# EasyEDA schematic SCH_eVSIF MB v0.2 MPSEE_2024-01-02.json

## Sheets
1 FT232: TITLE: FT232H; REV: 1.0; Date: 2023-12-28; Sheet: 1/1; Drawn By: Denjhang; Company: Denjiang's OSHW
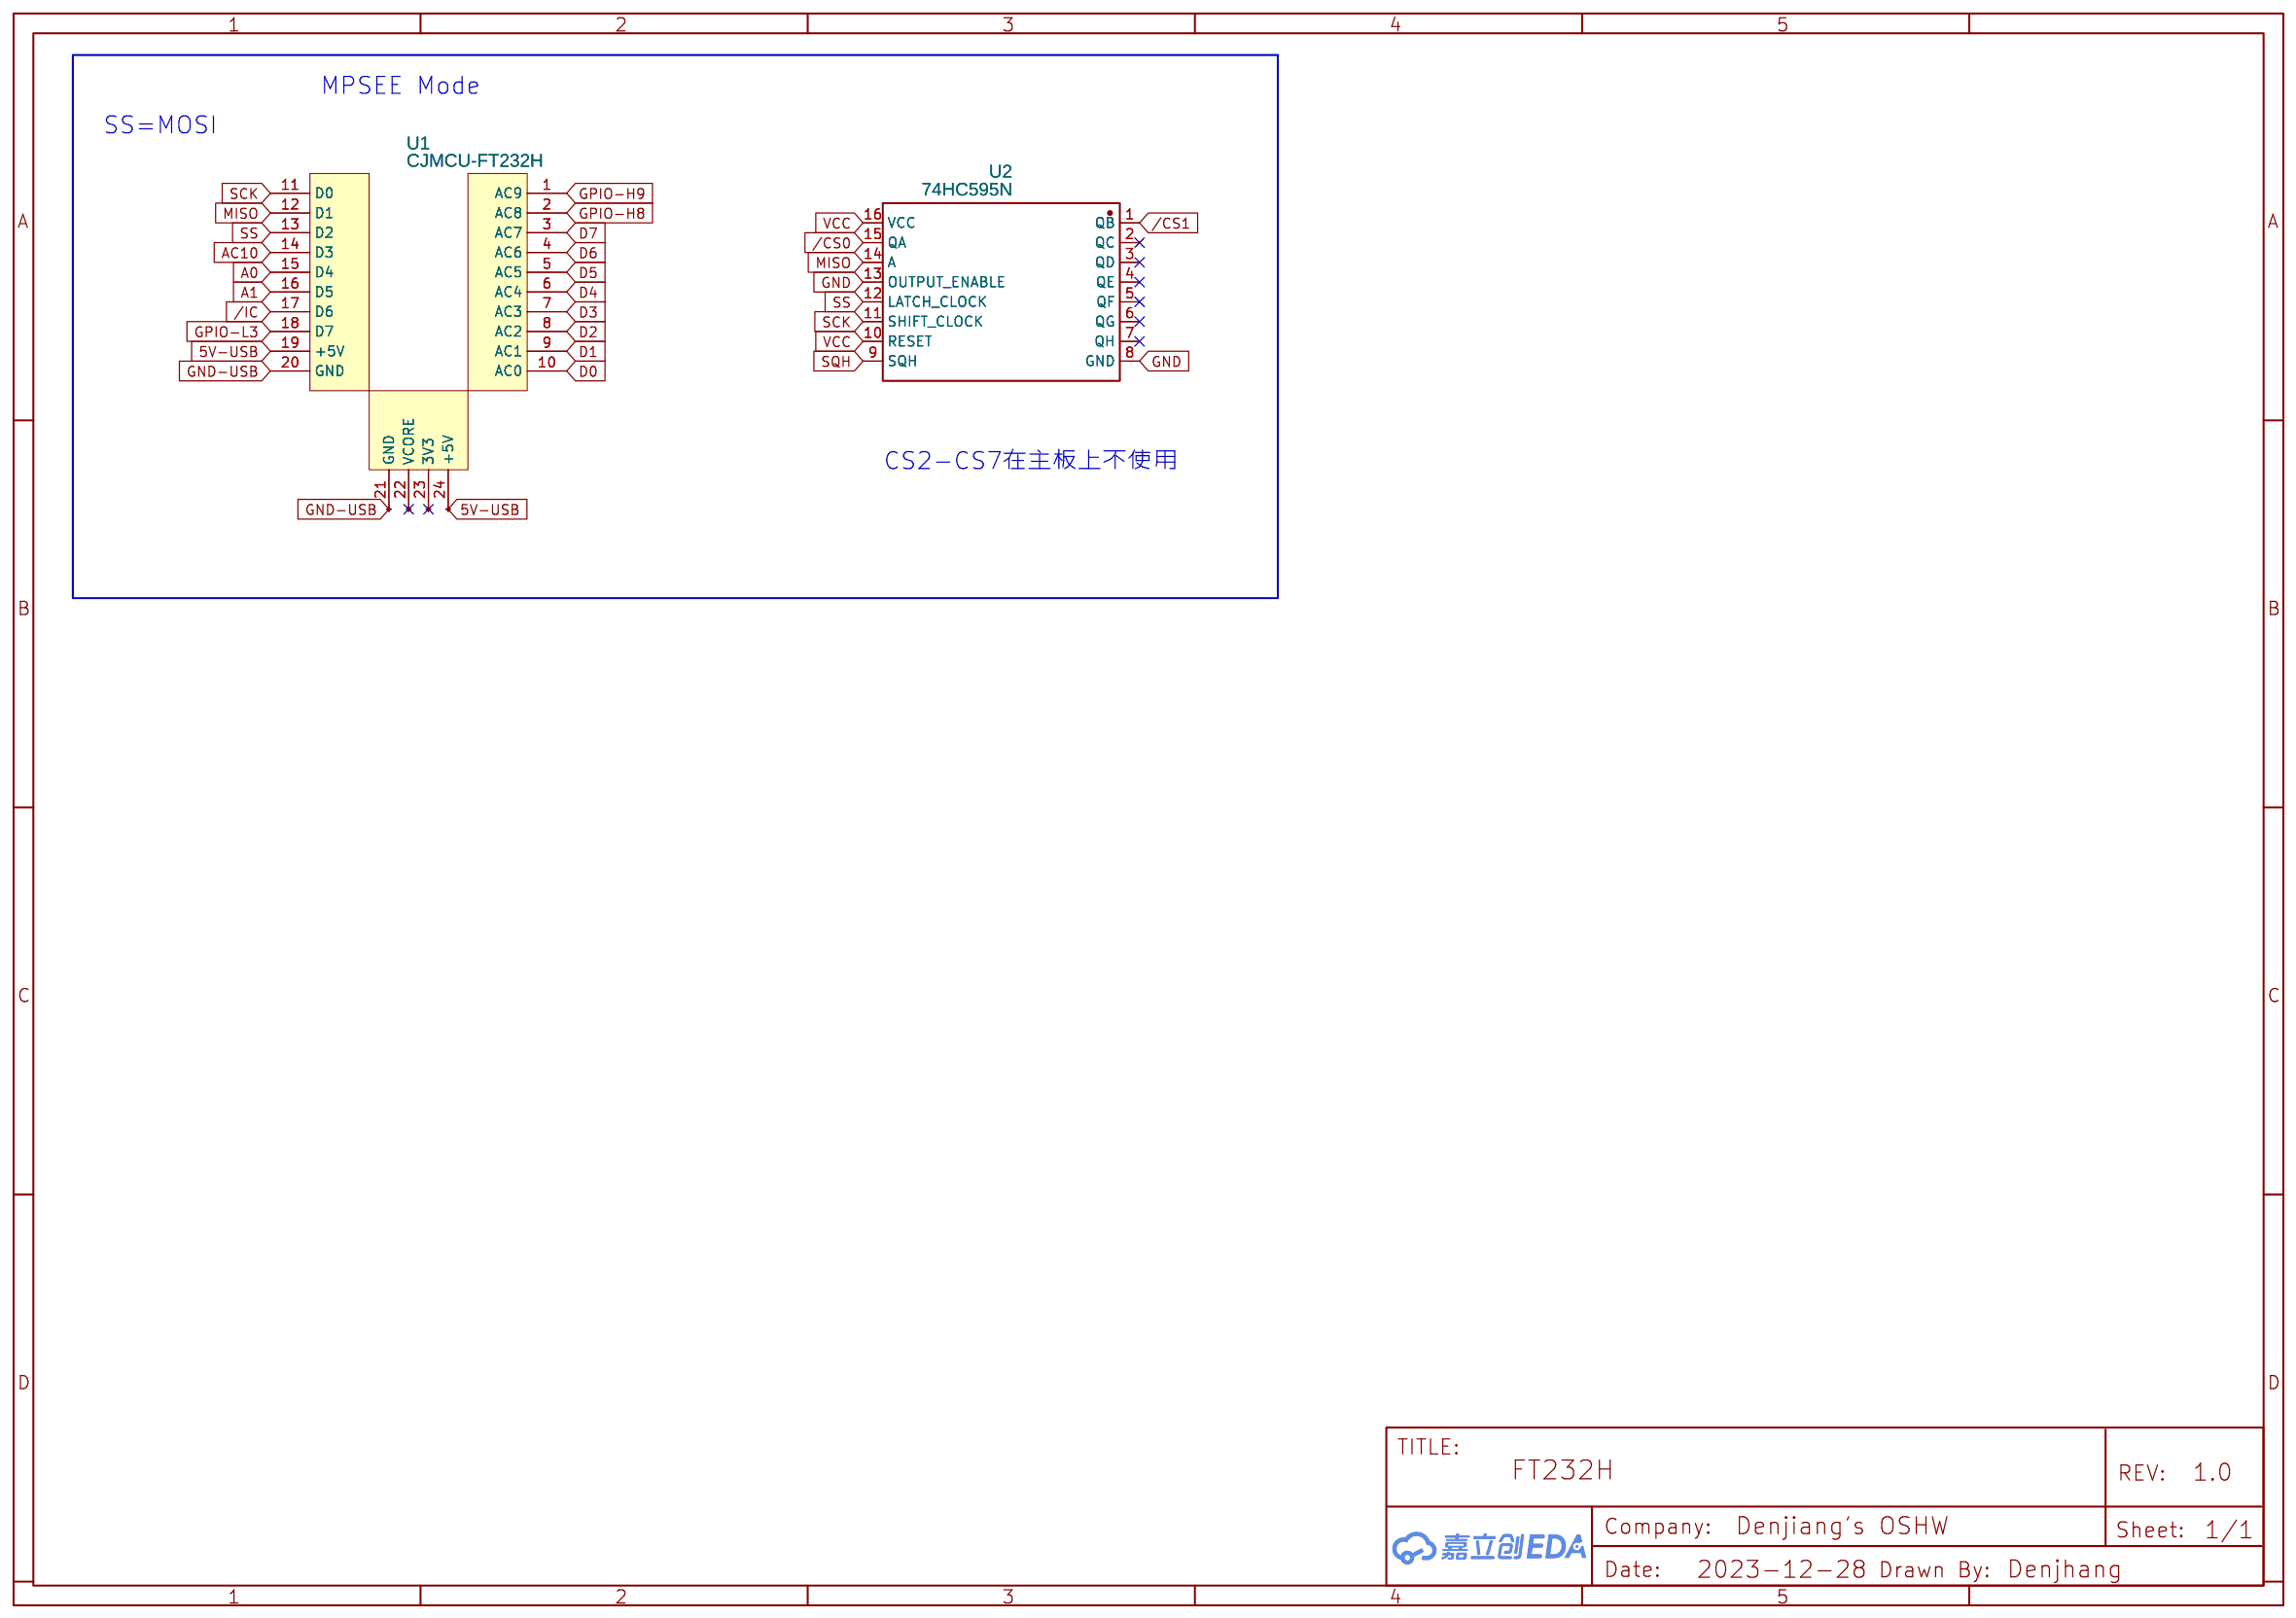
[diagram p0: FT232]
2 RE-BUS: TITLE: RE:birth BUS
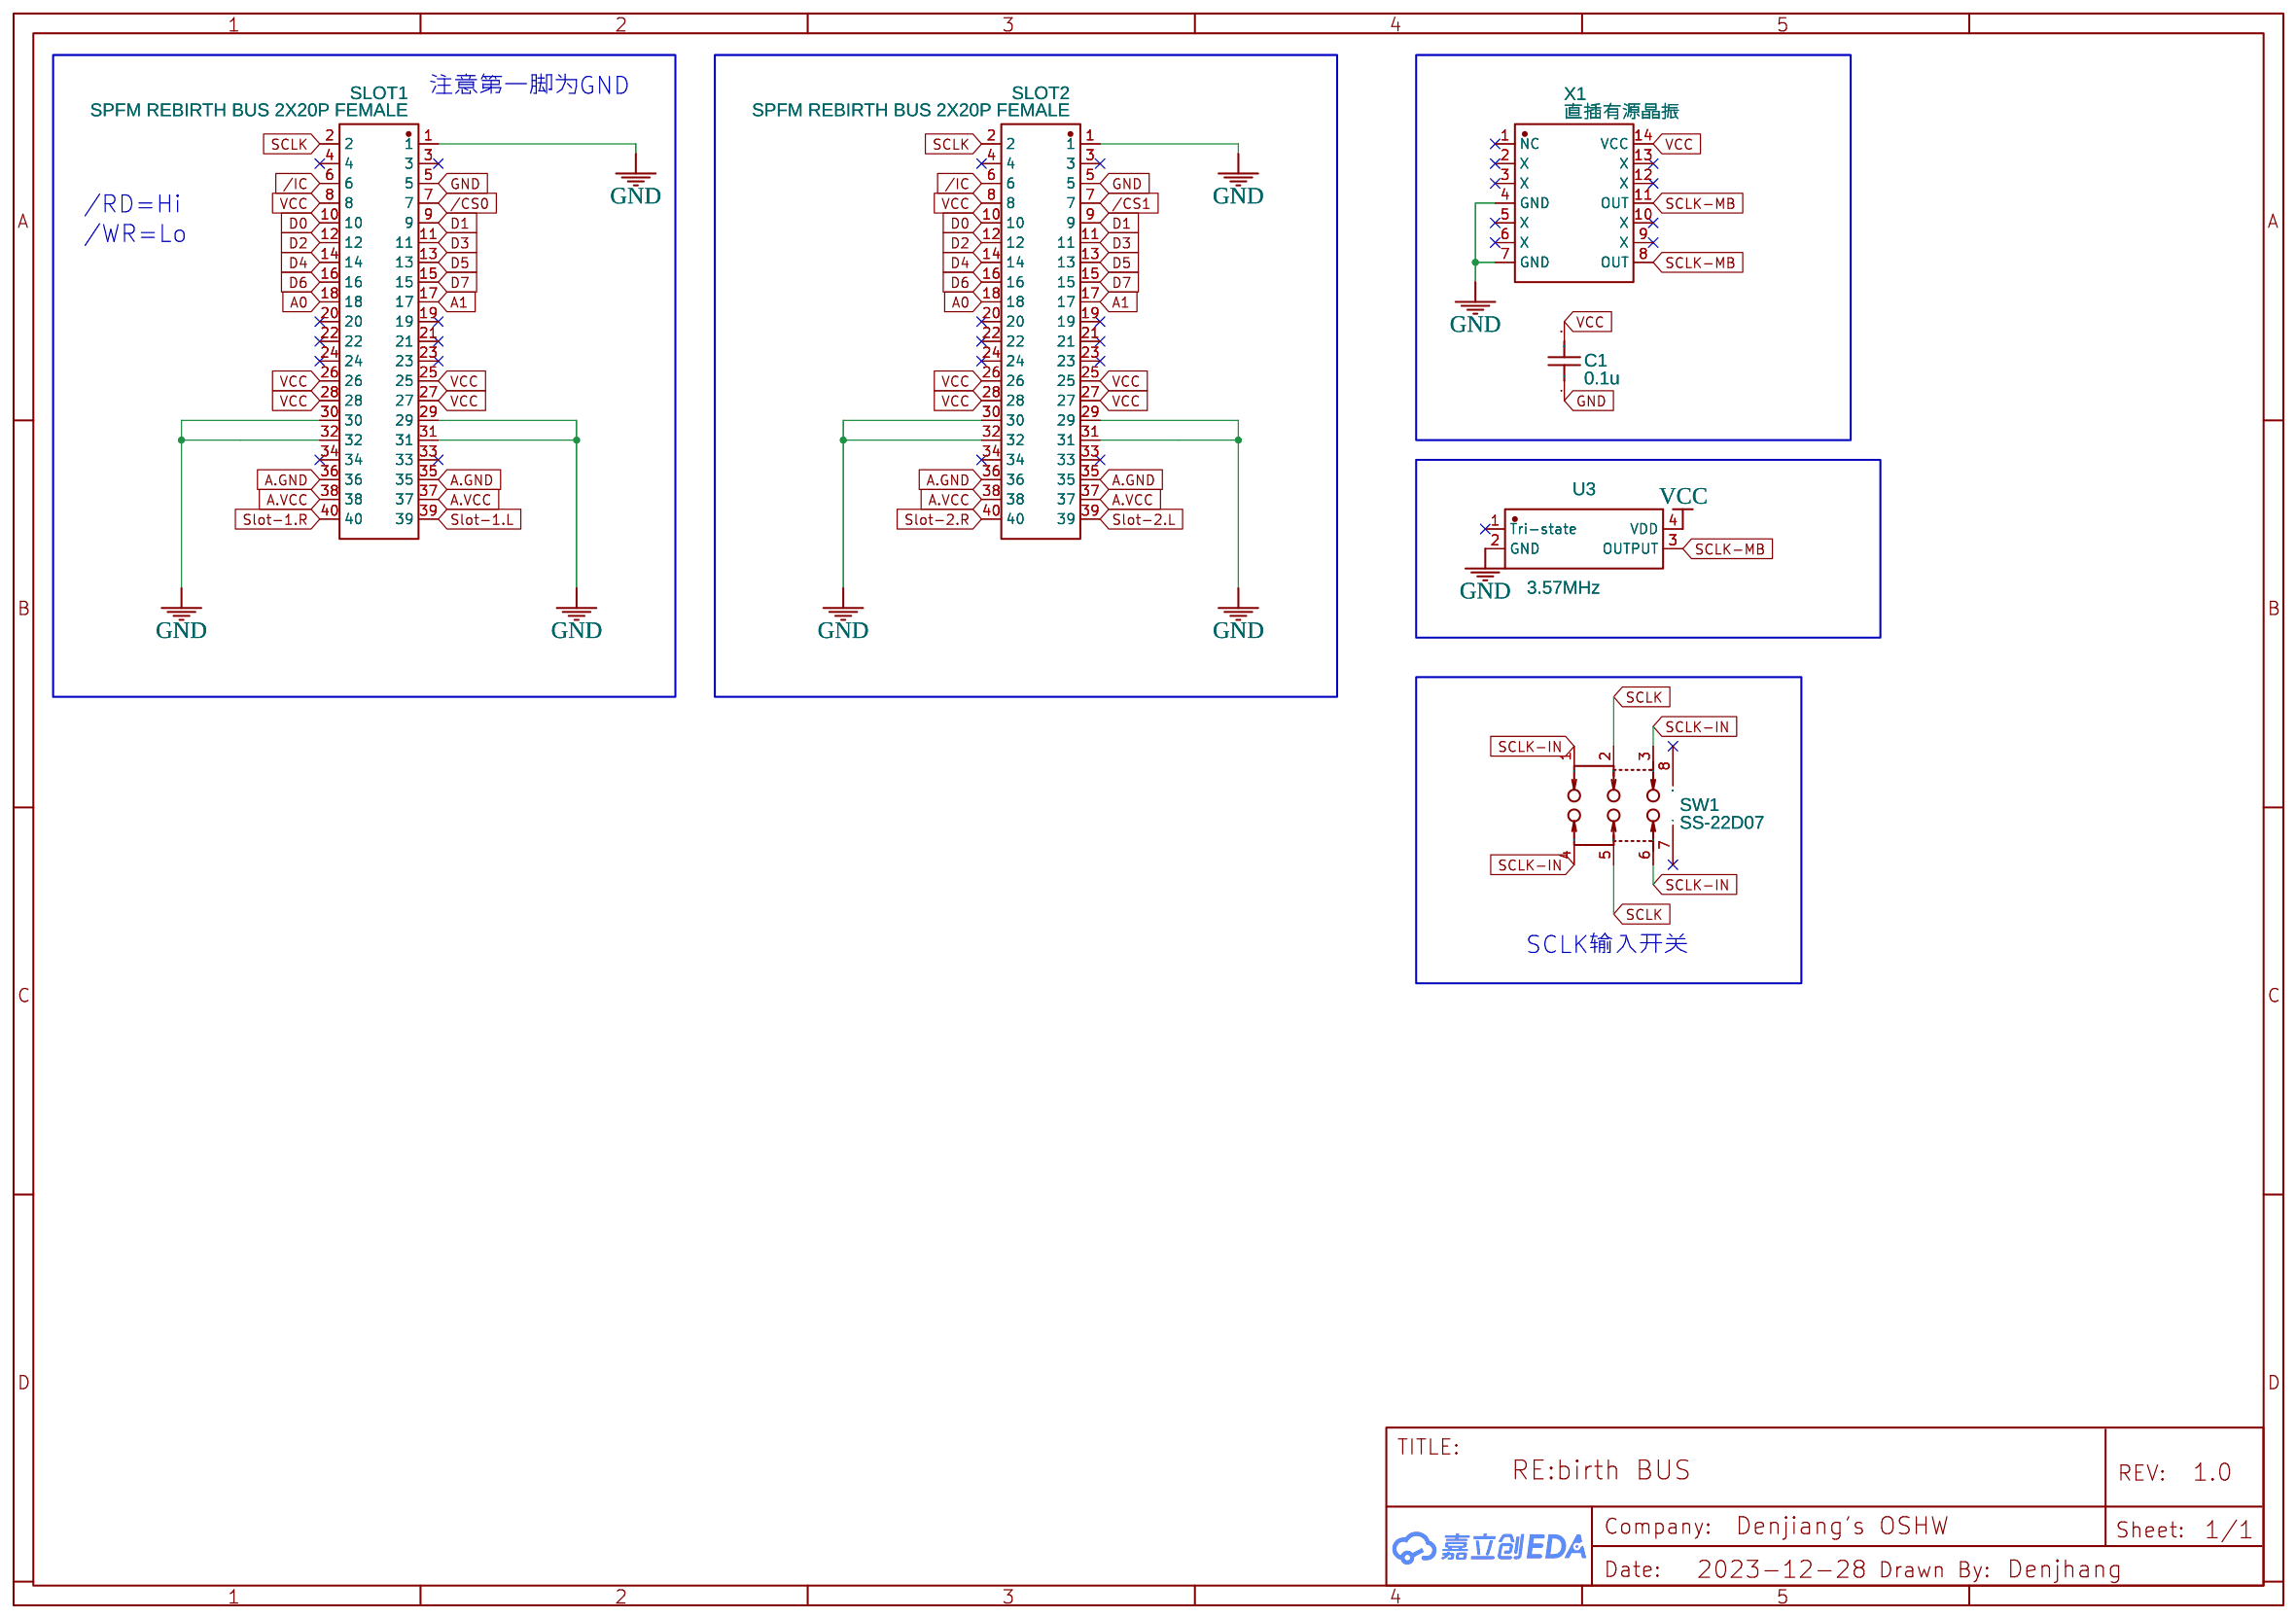
[diagram p1: RE-BUS]
3 PSU: TITLE: PSU
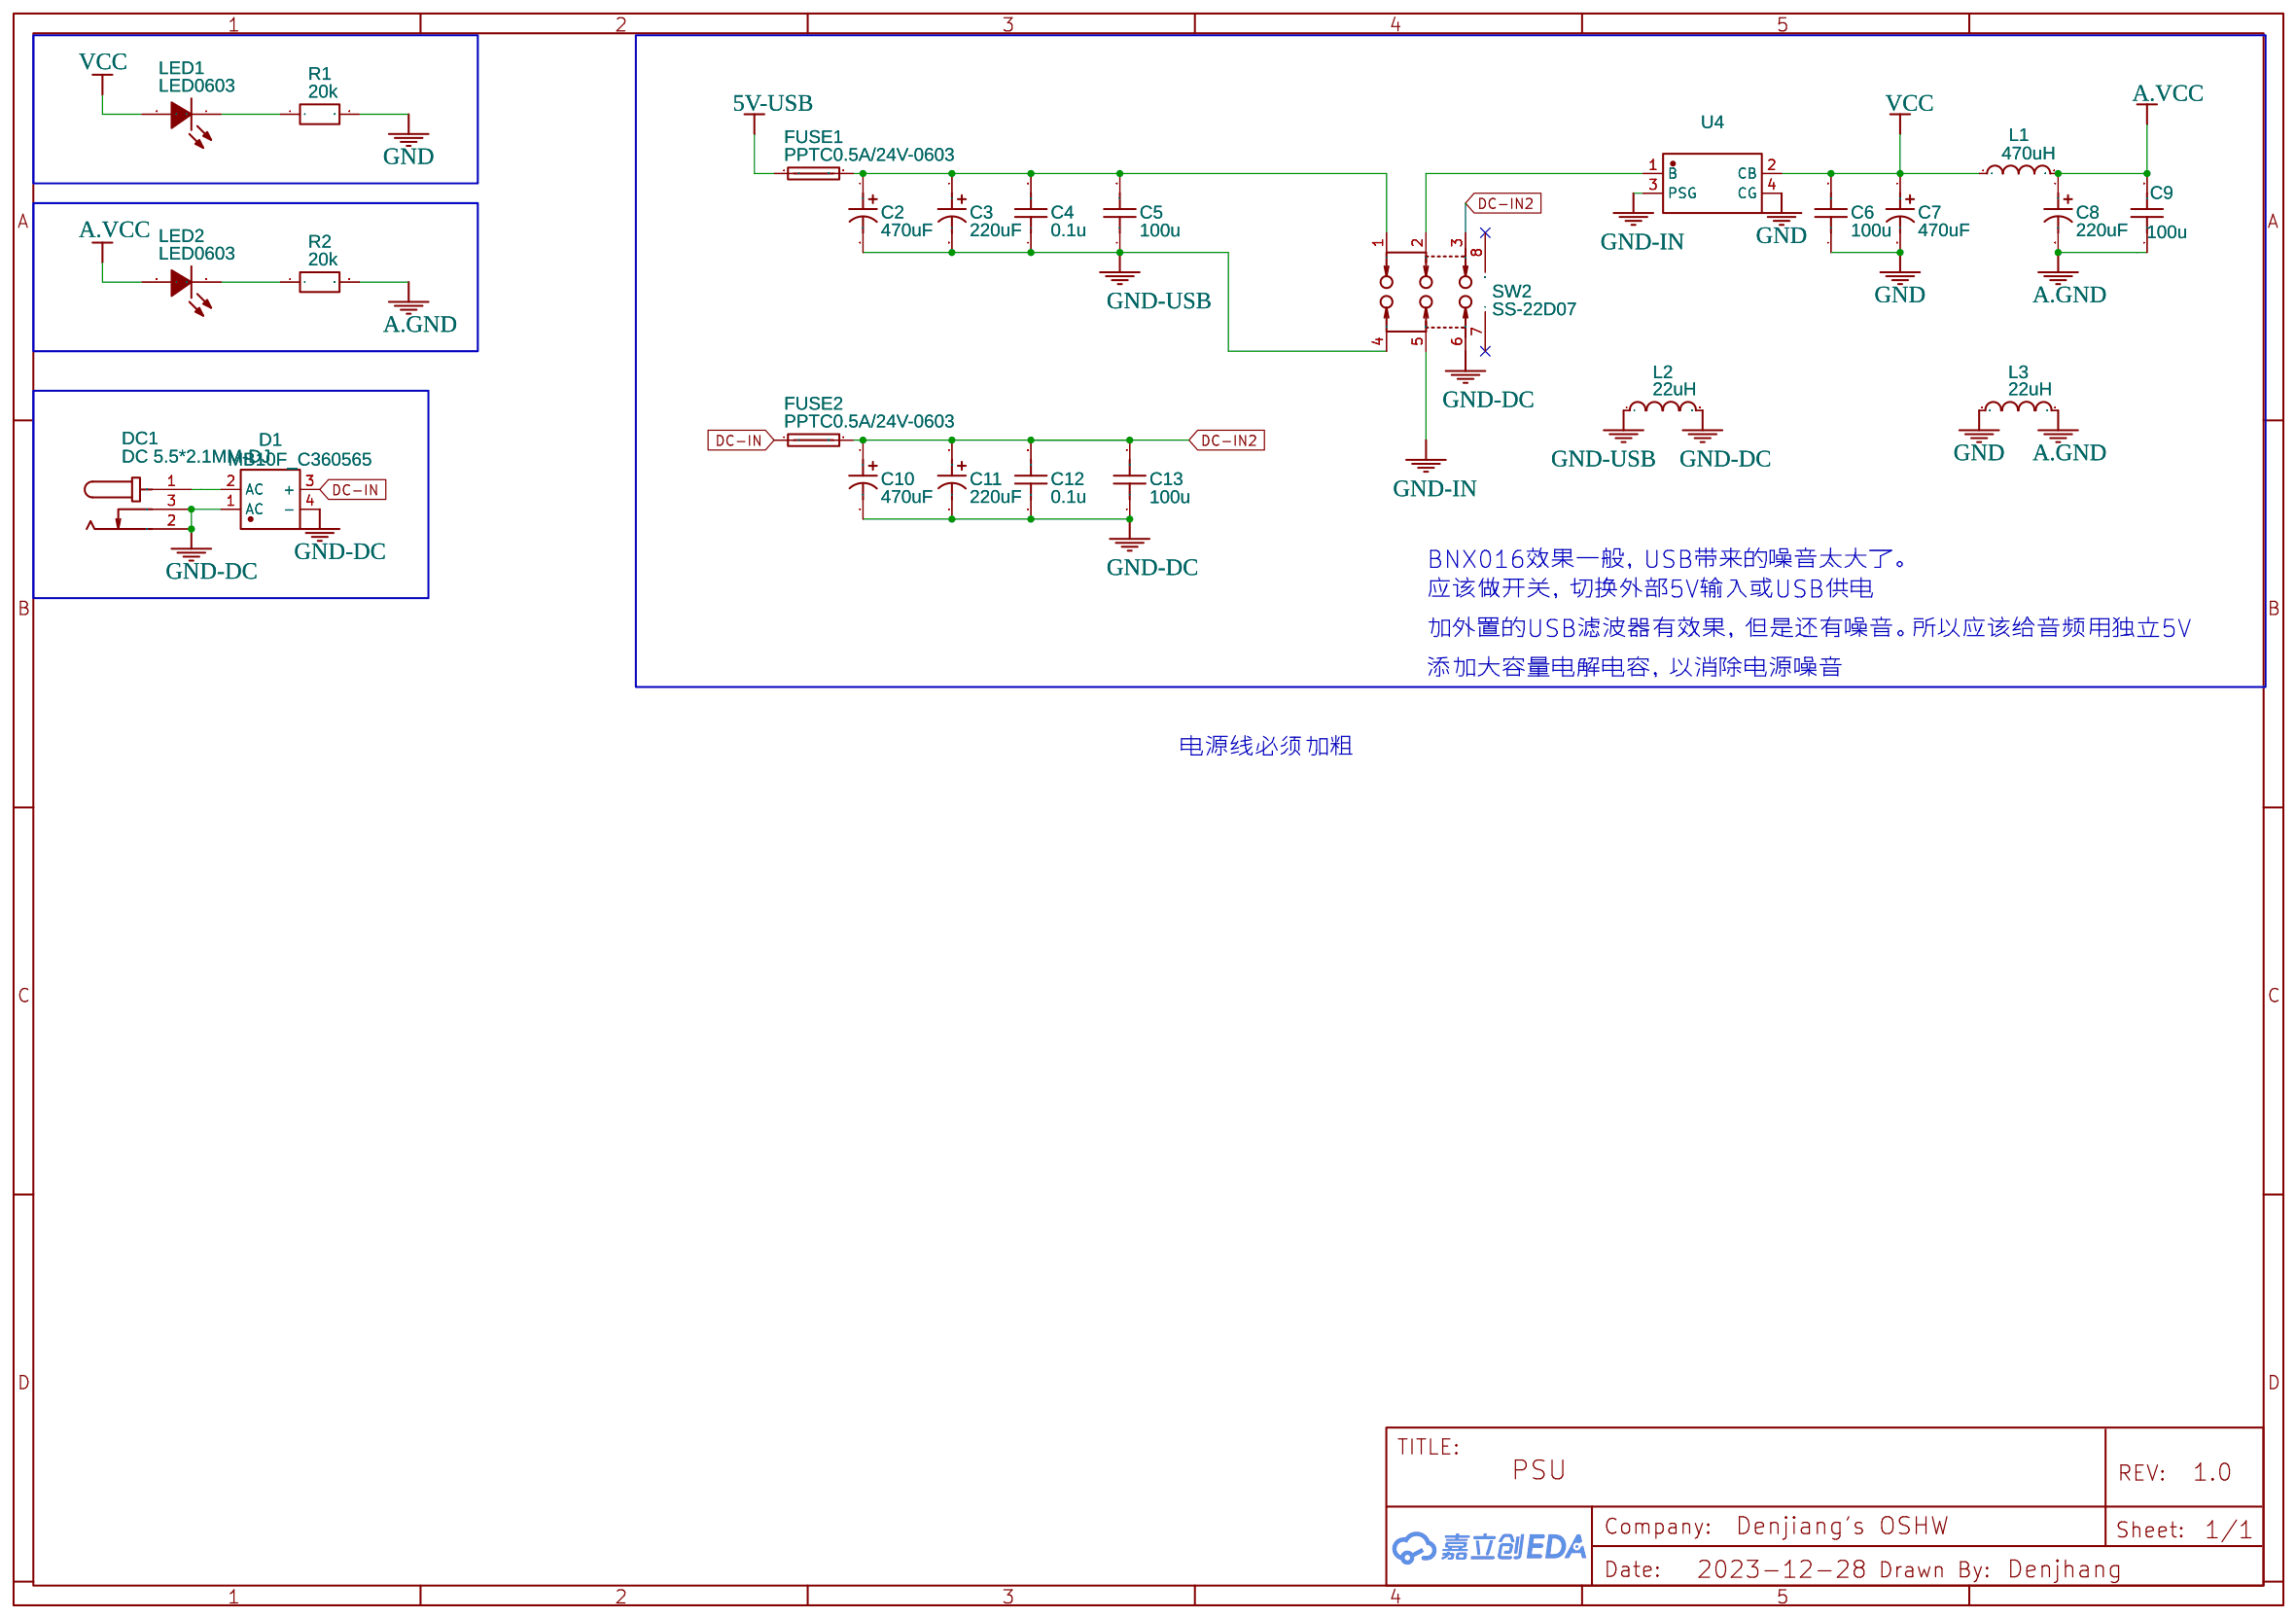
[diagram p2: PSU]
4 e-BUS: TITLE: eVSIF BUS
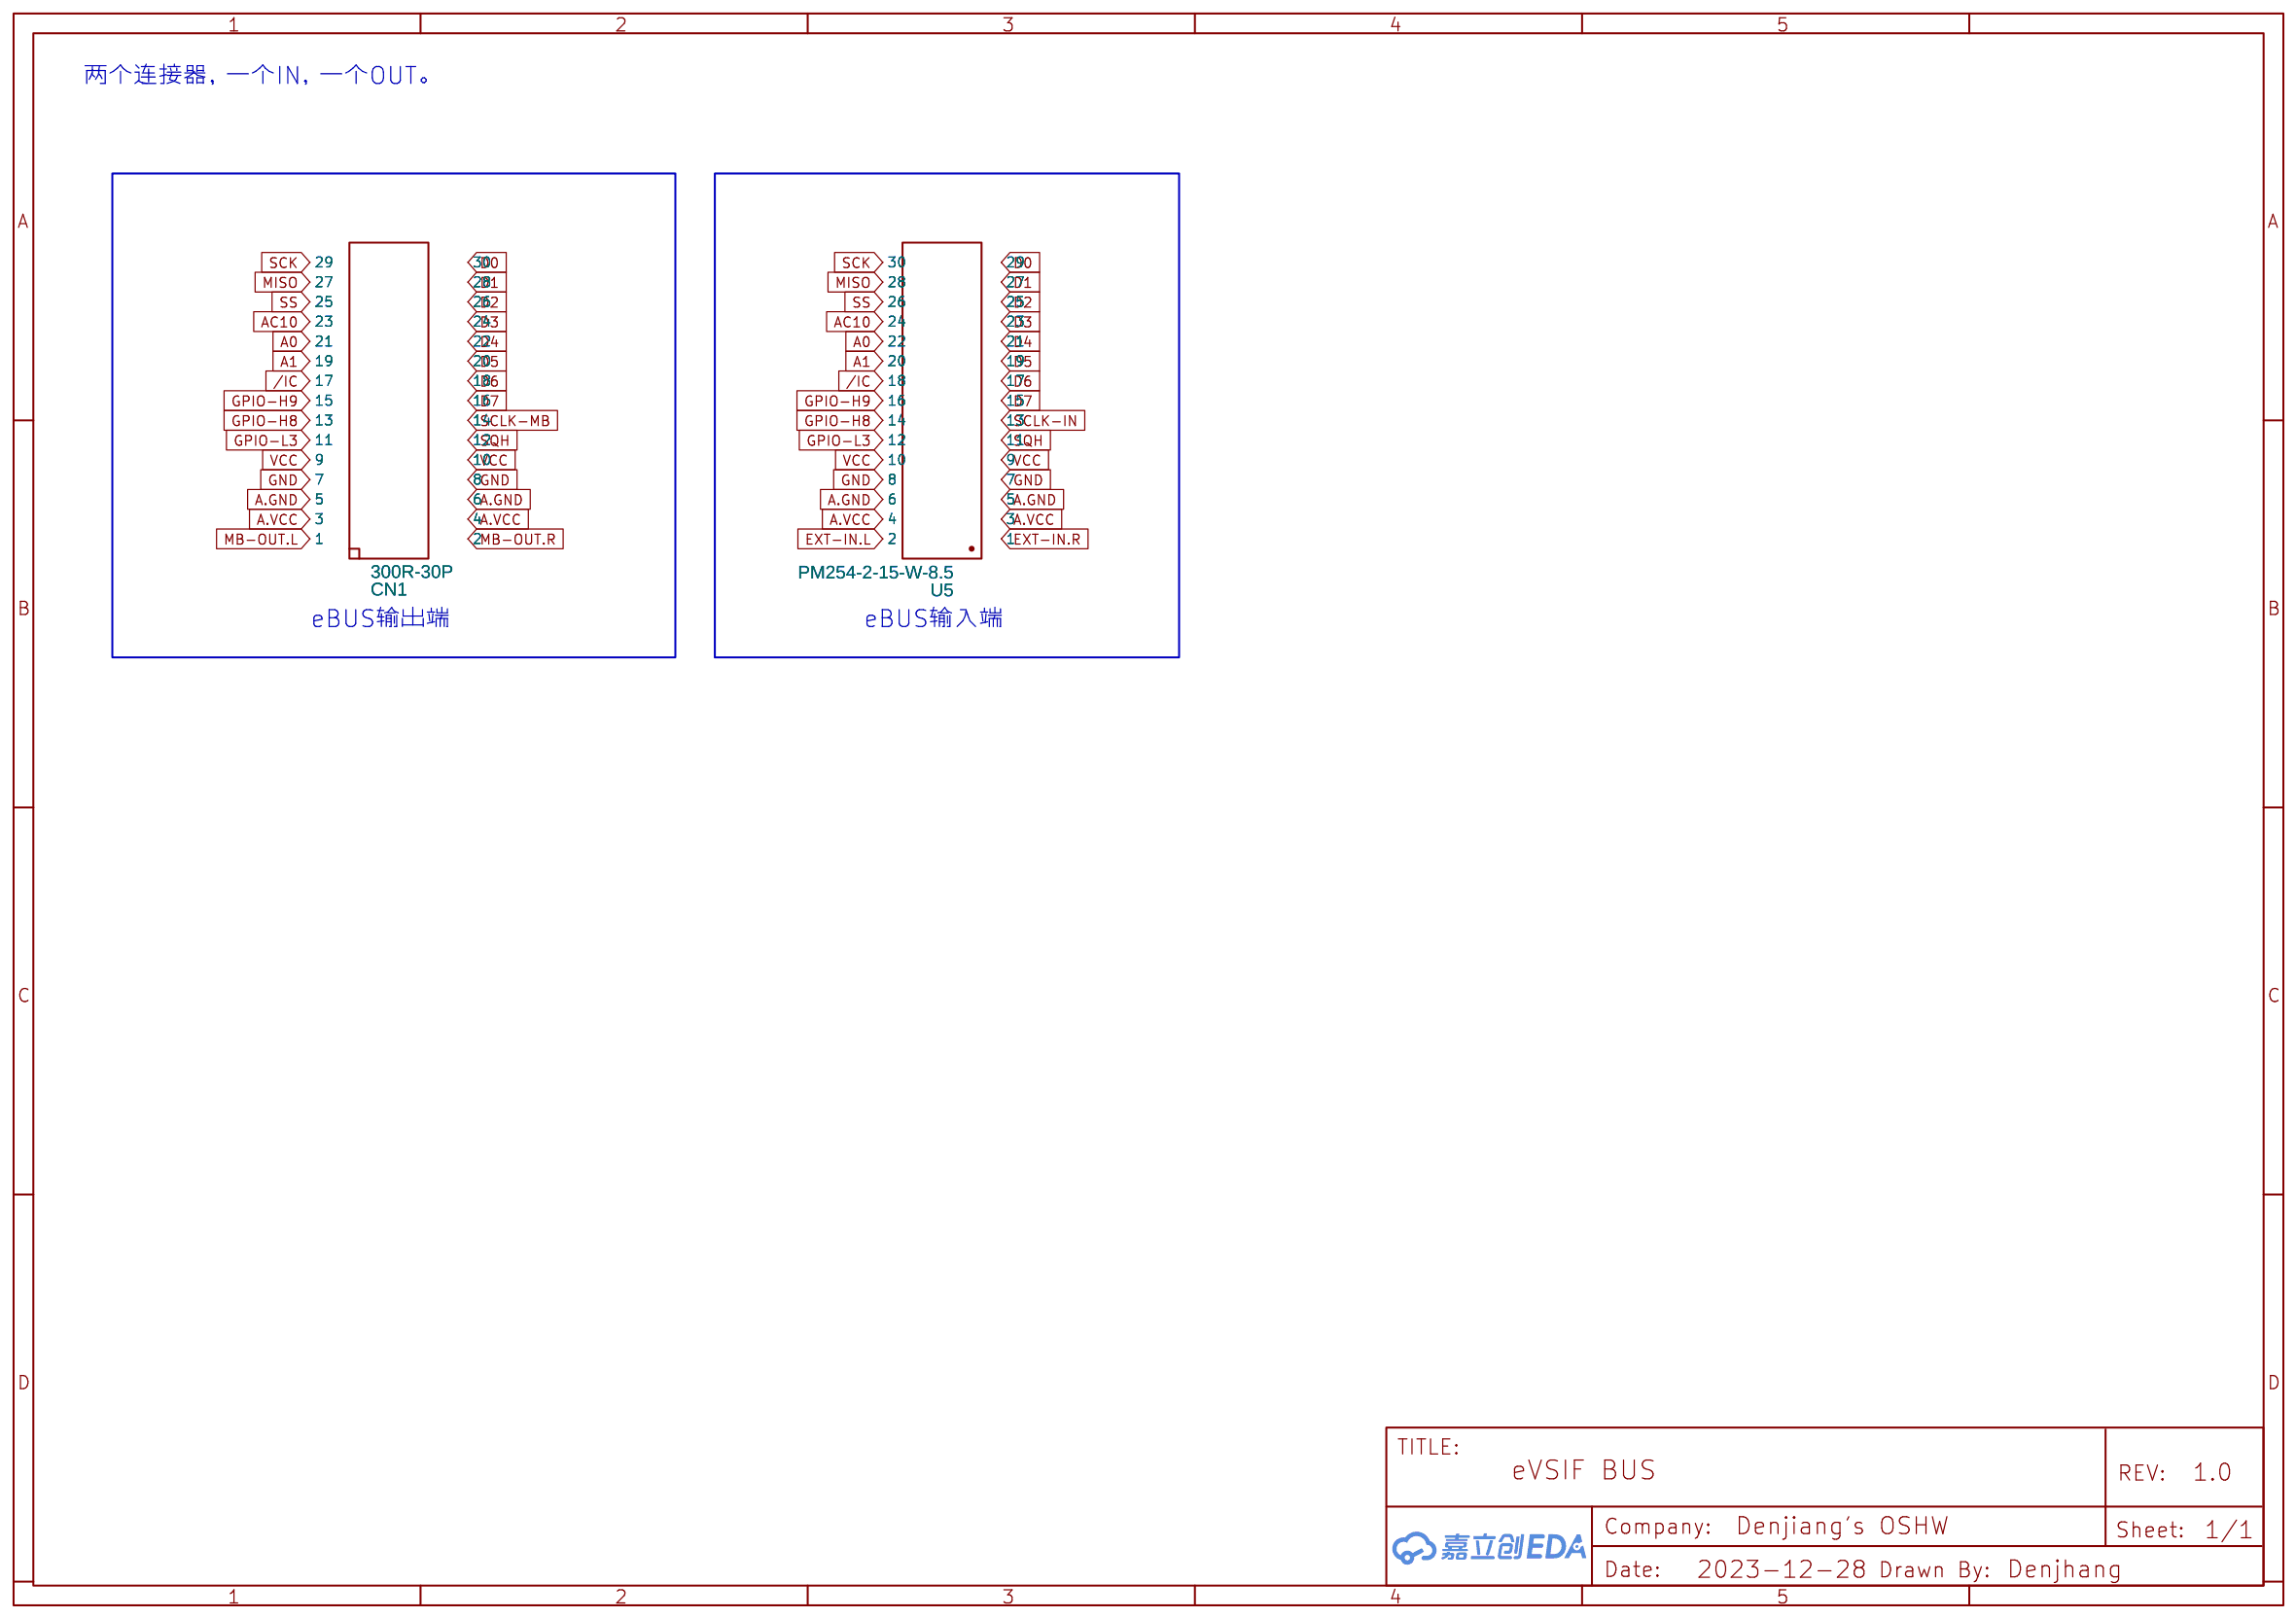
[diagram p3: e-BUS]
5 Mixer: TITLE: Sheet_1; Company: Your Company
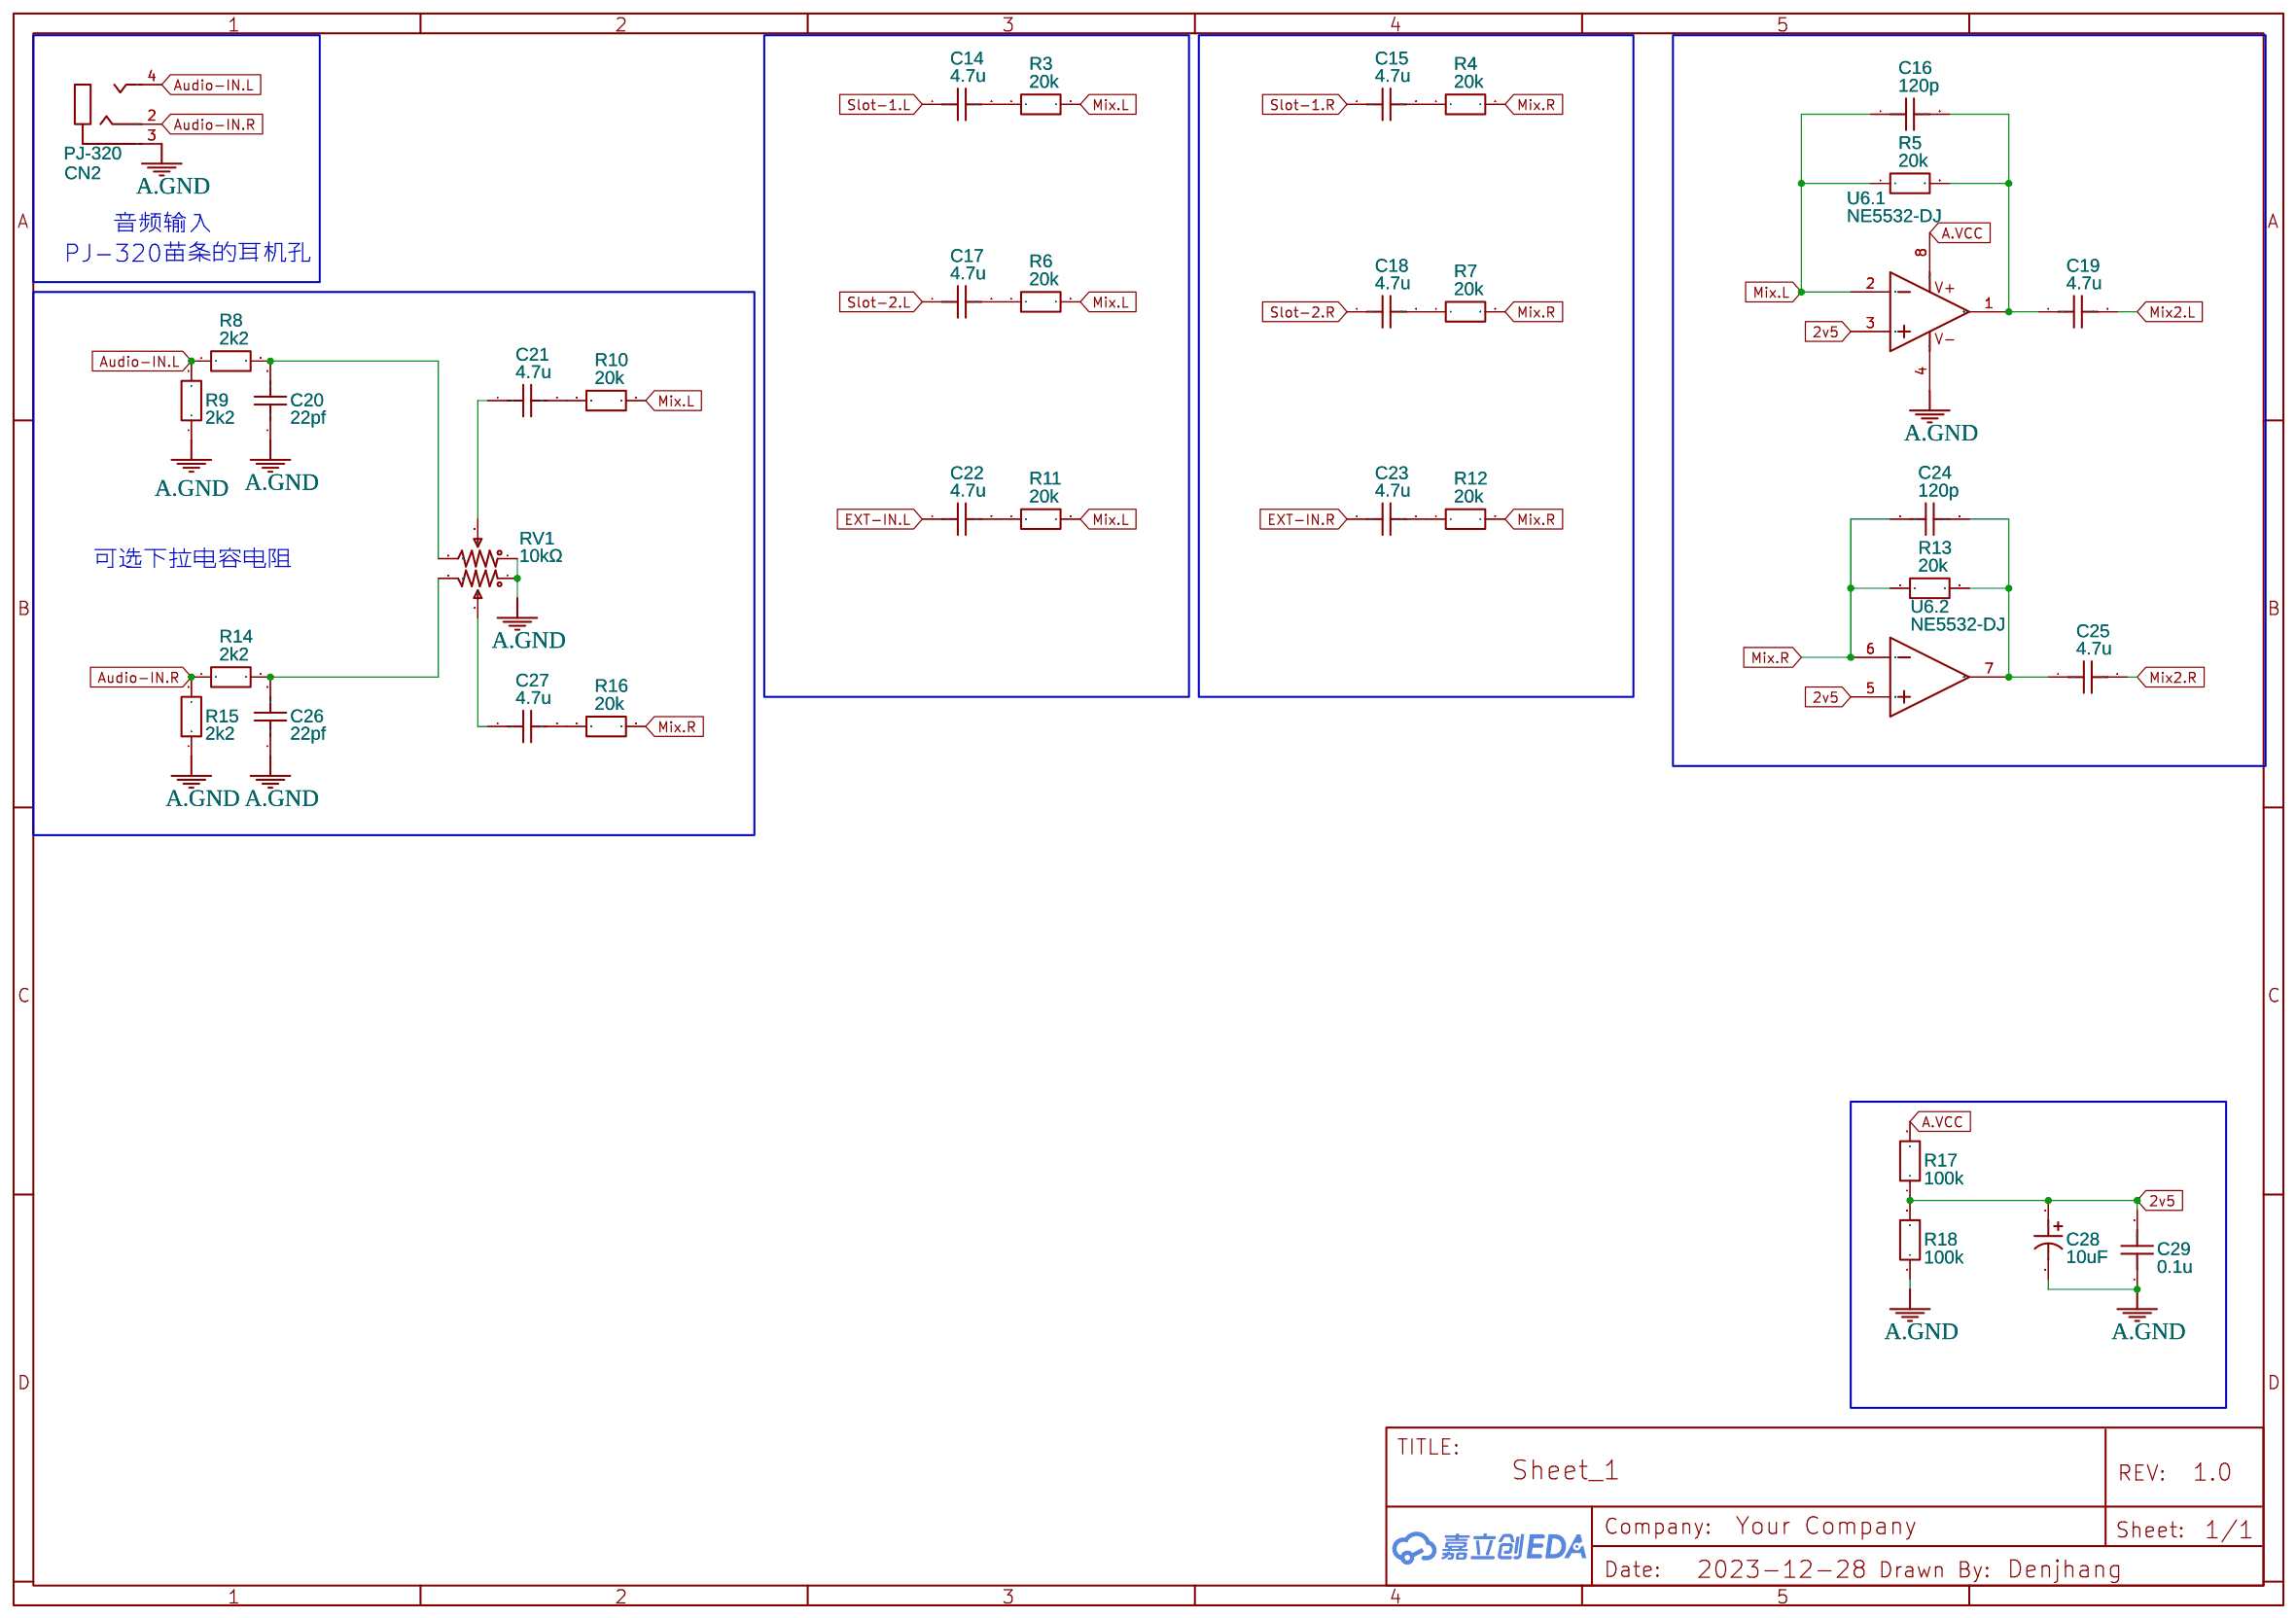
[diagram p4: Mixer]
6 Mixer2: TITLE: Sheet_1; Company: Your Company
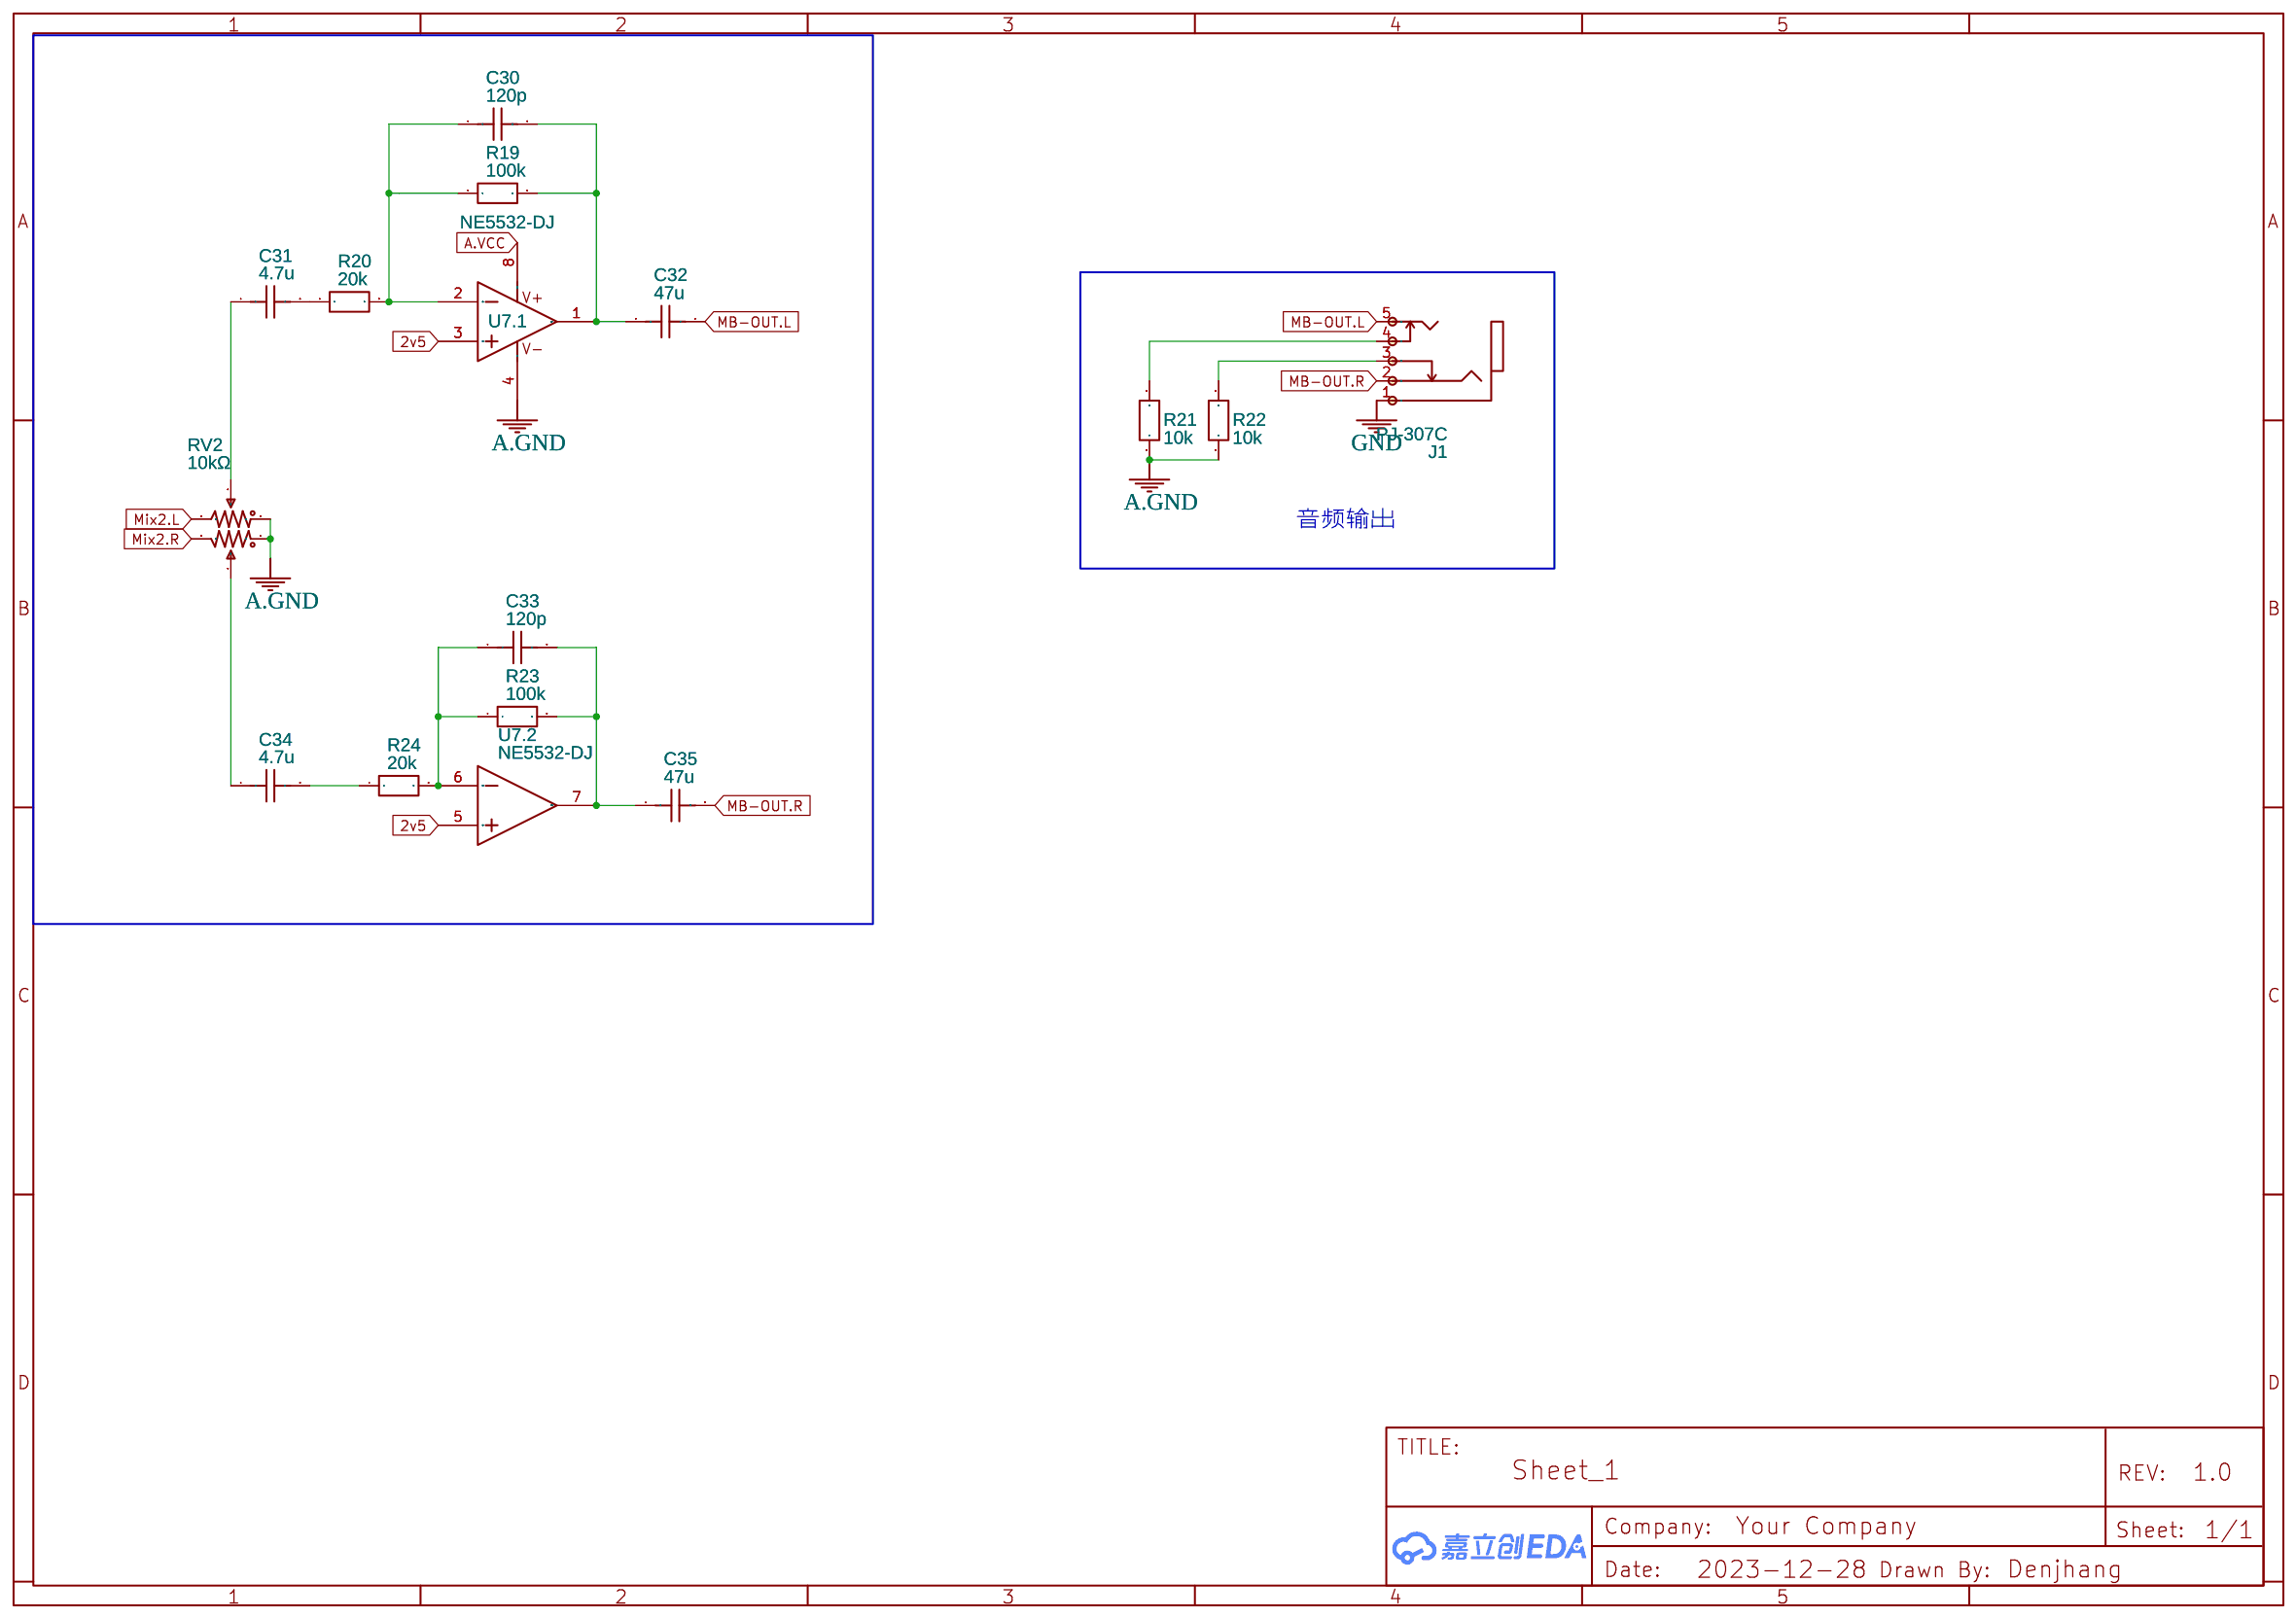
[diagram p5: Mixer2]

## Parts
sheet e-BUS
CN1  300R-30P  [IDC-TH_30P-P2.54_300R-30P]
U5  PM254-2-15-W-8.5  [HDR-TH_30P-P2.54-H-F-R2-C15-W8.5]
sheet FT232
U1  CJMCU-FT232H  [CJMCU-FT232H-DJ]
U2  74HC595N  [DIP-16_L20.0-W6.4-P2.54-LS7.6-BL]
sheet Mixer2
C30  120p  [C0603]
C31  4.7u  [C0603]
C32  47u  [C0805]
C33  120p  [C0603]
C34  4.7u  [C0603]
C35  47u  [C0805]
J1  PJ-307C  [AUDIO-TH_PJ307C]
R19  100k  [R0603]
R20  20k  [R0603]
R21  10k  [R0603]
R22  10k  [R0603]
R23  100k  [R0603]
R24  20k  [R0603]
RV2  10kΩ  [RK097G-DJ]
U7  NE5532-DJ  [DIP-8-DJ]  (sections 1,2)
sheet Mixer
C14  4.7u  [C0603]
C15  4.7u  [C0603]
C16  120p  [C0603]
C17  4.7u  [C0603]
C18  4.7u  [C0603]
C19  4.7u  [C0603]
C20  22pf  [C0603]
C21  4.7u  [C0603]
C22  4.7u  [C0603]
C23  4.7u  [C0603]
C24  120p  [C0603]
C25  4.7u  [C0603]
C26  22pf  [C0603]
C27  4.7u  [C0603]
C28  10uF  [CAP-SMD_BD5.0-L5.3-W5.3-LS6.0-FD]
C29  0.1u  [C0603]
CN2  PJ-320  [AUDIO-TH_HOOYA_PJ-320]
R3  20k  [R0603]
R4  20k  [R0603]
R5  20k  [R0603]
R6  20k  [R0603]
R7  20k  [R0603]
R8  2k2  [R0603]
R9  2k2  [R0603]
R10  20k  [R0603]
R11  20k  [R0603]
R12  20k  [R0603]
R13  20k  [R0603]
R14  2k2  [R0603]
R15  2k2  [R0603]
R16  20k  [R0603]
R17  100k  [R0603]
R18  100k  [R0603]
RV1  10kΩ  [RK097G-DJ]
U6  NE5532-DJ  [DIP-8-DJ]  (sections 1,2)
sheet PSU
C2  470uF  [CAP-SMD_BD6.3-L6.6-W6.6-FD]
C3  220uF  [CAP-SMD_BD6.3-L6.6-W6.6-LS7.2-FD]
C4  0.1u  [C0603]
C5  100u  [C1206]
C6  100u  [C1206]
C7  470uF  [CAP-SMD_BD6.3-L6.6-W6.6-LS7.2-FD]
C8  220uF  [CAP-SMD_BD6.3-L6.6-W6.6-LS7.2-FD]
C9  100u  [C1206]
C10  470uF  [CAP-SMD_BD6.3-L6.6-W6.6-FD]
C11  220uF  [CAP-SMD_BD6.3-L6.6-W6.6-LS7.2-FD]
C12  0.1u  [C0603]
C13  100u  [C1206]
D1  MB10F_C360565  [DIO-BG-SMD_MBF]
DC1  DC 5.5*2.1MM-DJ  [DC-IN-TH_HX-DC005-2.5-DJ]
FUSE1  PPTC0.5A/24V-0603  [F0603]
FUSE2  PPTC0.5A/24V-0603  [F0603]
L1  470uH  [IND-SMD_L5.8-W5.2]
L2  22uH  [IND-SMD_L4.4-W4.0_PHC0420]
L3  22uH  [IND-SMD_L4.4-W4.0_PHC0420]
LED1  LED0603  [LED0603-RD]
LED2  LED0603  [LED0603-RD]
R1  20k  [R0603]
R2  20k  [R0603]
SW2  SS-22D07  [SW-TH_SS-22D07]
U4  NO  [FILTER-TH_6P-L12.0-W11.0_BNX016-01]
sheet RE-BUS
C1  0.1u  [C0603]
SLOT1  SPFM REBIRTH BUS 2X20P FEMALE  [SPFM REBIRTH BUS 2X20P FEMALE]
SLOT2  SPFM REBIRTH BUS 2X20P FEMALE  [SPFM REBIRTH BUS 2X20P FEMALE]
SW1  SS-22D07  [SW-TH_SS-22D07]
U3  3.57MHz  [OSC-SMD_4P-L3.2-W2.5-BL]
X1  直插有源晶振  [DIP14-有源晶振]

## Library data of the parts
CN1 = 300R-30P: Contributor: LCSC; Supplier: LCSC; Manufacturer: Ckmtw(灿科盟); Manufacturer Part: B-3000R30P-0110; Supplier Part: C146627; JLCPCB Part Class: Extended Part; link: https://so.szlcsc.com/global.html?k=C146627&ref=editor
U5 = PM254-2-15-W-8.5: Contributor: LCSC; Supplier: LCSC; Supplier Part: C2897435; Manufacturer: HCTL(华灿天禄); JLCPCB Part Class: Extended Part; link: https://so.szlcsc.com/global.html?k=C2897435&ref=editor
U1 = CJMCU-FT232H: Contributor: Denjhang
U2 = 74HC595N: Contributor: LCSC; Supplier: LCSC; Supplier Part: C507175; Manufacturer: HGSEMI(华冠); JLCPCB Part Class: Extended Part; link: https://so.szlcsc.com/global.html?k=C507175&ref=editor
C1 C4 C12 C14-C27 C29-C31 C33 C34 = C_0603_US: Contributor: LCEDA_Lib
C32 C35 = C_0805_US: Contributor: LCEDA_Lib
J1 = PJ-307C: Supplier: LCSC; Manufacturer: BOOMELE; Supplier Part: C16684; JLCPCB Part Class: Extended Part
R1-R24 = R_0603_EU: Contributor: LCEDA_Lib
RV1 RV2 = RK097-双连体: Contributor: LCSC; Supplier: LCSC; Supplier Part: C231763; Manufacturer: ALPSALPINE(阿尔卑斯阿尔派); Manufacturer Part: RK09712200MY; JLCPCB Part Class: Extended Part
U6 U7 = NE5532-DJ: tags: Audio Operational Amplifier; Supplier Part: C5326; Supplier: LCSC; Manufacturer: TI; Manufacturer Part: NE5532P; subpart_no: 1; image: http://image.lceda.cn/szlcsc/C5326.jpg; JLCPCB Part Class: Extended Part; Contributor: Denjhang
C28 = RVT100UF10V67RV0036: Contributor: LCSC; Supplier: LCSC; Supplier Part: C2891567; Manufacturer: KNSCHA(科尼盛); JLCPCB Part Class: Extended Part; link: https://so.szlcsc.com/global.html?k=C2891567&ref=editor
CN2 = PJ-320: Supplier: LCSC; Supplier Part: C2939180; Manufacturer: HOOYA(皓宇电子); Contributor: LCSC; JLCPCB Part Class: Extended Part
C2 C10 = RVT220UF16V67RV0015: Contributor: LCSC; Supplier: LCSC; Supplier Part: C2887273; Manufacturer: KNSCHA(科尼盛); JLCPCB Part Class: Extended Part; link: https://so.szlcsc.com/global.html?k=C2887273&ref=editor
C3 C7 C8 C11 = RVT47UF35V67RV0039: Contributor: LCSC; Supplier: LCSC; Supplier Part: C2836440; Manufacturer: KNSCHA(科尼盛); JLCPCB Part Class: Extended Part; link: https://so.szlcsc.com/global.html?k=C2836440&ref=editor
C5 C6 C9 C13 = C_1206_US: Contributor: LCEDA_Lib
D1 = MB10F_C360565: Contributor: LCSC; Supplier: LCSC; Supplier Part: C360565; Manufacturer: PINGWEI(平伟); Manufacturer Part: MB10F; JLCPCB Part Class: Extended Part; link: https://so.szlcsc.com/global.html?k=C360565&ref=editor
DC1 = DC 5.5*2.1MM-DJ: Supplier: LCSC; Manufacturer: HRO; Manufacturer Part: DC-005-20A; Contributor: LYMarvin; Supplier Part: C136744
FUSE1 FUSE2 = PPTC0.5A/24V-0603: Contributor: LCSC; Supplier: LCSC; Supplier Part: C9900007586; Manufacturer: null; Manufacturer Part: PPTC0.5A/24V 自恢复保险丝-0603; JLCPCB Part Class: Extended Part
L1 = MSCD54-471KT: Contributor: LCSC; Supplier: LCSC; Supplier Part: C915206; Manufacturer: Meled(美莱); JLCPCB Part Class: Extended Part; link: https://so.szlcsc.com/global.html?k=C915206&ref=editor
L2 L3 = APH0420T2R2M: Contributor: lcsc; Supplier: LCSC; Supplier Part: C5349665; Manufacturer: APV(爱普微); JLCPCB Part Class: Extended Part; link: https://so.szlcsc.com/global.html?k=C5349665&ref=editor
LED1 LED2 = LED0603: Supplier: LCSC; Supplier Part: C2892154; Manufacturer: GBG; Manufacturer Part: GBG-C192KRKT; link: https://atta.szlcsc.comnull; Contributor: Denjhang
SW1 SW2 = SS-22D07: Supplier Part: C34982; Supplier: LCSC; Manufacturer: ReliaPro; JLCPCB Part Class: Extended Part; link: https://so.szlcsc.com/global.html?k=C34982&ref=editor
U4 = BNX016-01: Supplier: LCSC; Supplier Part: C393167; Manufacturer: Murata Electronics; Contributor: youthol; JLCPCB Part Class: Extended Part
SLOT1 SLOT2 = SPFM REBIRTH BUS 2X20P FEMALE: Contributor: LCSC; Supplier: LCSC; Supplier Part: C2897421; Manufacturer: HCTL(华灿天禄); Manufacturer Part: PM254-2-20-Z-8.5; JLCPCB Part Class: Extended Part
U3 = OT32254MJBA4SL: Contributor: lcsc; Supplier: LCSC; Supplier Part: C2831397; Manufacturer: YXC(扬兴晶振); JLCPCB Part Class: Extended Part; link: https://so.szlcsc.com/global.html?k=C2831397&ref=editor
X1 = 直插有源晶振: Contributor: denjhang

## Nets
2v5: C28.1 C29.2 R17.1 R18.2 U6.3(IN1+) U6.5(IN2+) U7.3(IN1+) U7.5(IN2+)
5V-USB: FUSE1.1 U1.19(+5V) U1.24(+5V)
GND: C1.1 C6.1 C7.2 CN1.7 CN1.8 J1.1 L3.1 R1.2 SLOT1.1 SLOT1.5 SLOT1.29 SLOT1.30 SLOT1.31 SLOT1.32 SLOT2.1 SLOT2.5 SLOT2.29 SLOT2.30 SLOT2.31 SLOT2.32 U2.8(GND) U2.13(OUTPUT_ENABLE) U3.2(GND) U4.4(CG) U5.7 U5.8 X1.4(GND) X1.7(GND)
GND-DC: C10.2 C11.2 C12.1 C13.1 D1.1(AC) D1.4(-) DC1.2 DC1.3 L2.2 SW2.6
GND-IN: SW2.5 U4.3(PSG)
GND-USB: C2.2 C3.2 C4.1 C5.1 L2.1 SW2.4 U1.20(GND) U1.21(GND)
VCC: C1.2 C6.2 C7.1 CN1.9 CN1.10 L1.1 LED1.2(A) SLOT1.8 SLOT1.25 SLOT1.26 SLOT1.27 SLOT1.28 SLOT2.8 SLOT2.25 SLOT2.26 SLOT2.27 SLOT2.28 U2.10(RESET) U2.16(VCC) U3.4(VDD) U4.2(CB) U5.9 U5.10 X1.14(VCC)
/CS0: SLOT1.7 U2.15(QA)
/CS1: SLOT2.7 U2.1(QB)
/IC: CN1.17 SLOT1.6 SLOT2.6 U1.17(D6) U5.18
A0: CN1.21 SLOT1.18 SLOT2.18 U1.15(D4) U5.22
A1: CN1.19 SLOT1.17 SLOT2.17 U1.16(D5) U5.20
A.GND: C8.2 C9.1 C20.1 C26.1 C28.2 C29.1 CN1.5 CN1.6 CN2.3 L3.2 R2.2 R9.1 R15.1 R18.1 R21.1 R22.1 RV1.1 RV1.4 RV2.1 RV2.4 SLOT1.35 SLOT1.36 SLOT2.35 SLOT2.36 U5.5 U5.6 U6.4(VCC-) U7.4(VCC-)
A.VCC: C8.1 C9.2 CN1.3 CN1.4 L1.2 LED2.2(A) R17.2 SLOT1.37 SLOT1.38 SLOT2.37 SLOT2.38 U5.3 U5.4 U6.8(VCC+) U7.8(VCC+)
AC10: CN1.23 U1.14(D3) U5.24
Audio-IN.L: CN2.4 R8.1 R9.2
Audio-IN.R: CN2.2 R14.1 R15.2
D0: CN1.30 SLOT1.10 SLOT2.10 U1.10(AC0) U5.29
D1: CN1.28 SLOT1.9 SLOT2.9 U1.9(AC1) U5.27
D2: CN1.26 SLOT1.12 SLOT2.12 U1.8(AC2) U5.25
D3: CN1.24 SLOT1.11 SLOT2.11 U1.7(AC3) U5.23
D4: CN1.22 SLOT1.14 SLOT2.14 U1.6(AC4) U5.21
D5: CN1.20 SLOT1.13 SLOT2.13 U1.5(AC5) U5.19
D6: CN1.18 SLOT1.16 SLOT2.16 U1.4(AC6) U5.17
D7: CN1.16 SLOT1.15 SLOT2.15 U1.3(AC7) U5.15
DC-IN: D1.3(+) FUSE2.1
DC-IN2: C10.1 C11.1 C12.2 C13.2 FUSE2.2 SW2.3
EXT-IN.L: C22.1 U5.2
EXT-IN.R: C23.1 U5.1
GPIO-H8: CN1.13 U1.2(AC8) U5.14
GPIO-H9: CN1.15 U1.1(AC9) U5.16
GPIO-L3: CN1.11 U1.18(D7) U5.12
MB-OUT.L: C32.2 CN1.1 J1.5
MB-OUT.R: C35.2 CN1.2 J1.2
MISO: CN1.27 U1.12(D1) U2.14(A) U5.28
Mix2.L: C19.2 RV2.3
Mix2.R: C25.2 RV2.6
Mix.L: C16.1 R3.2 R5.1 R6.2 R10.2 R11.2 U6.2(IN1-)
Mix.R: C24.1 R4.2 R7.2 R12.2 R13.1 R16.2 U6.6(IN2-)
SCK: CN1.29 U1.11(D0) U2.11(SHIFT_CLOCK) U5.30
SCLK: SLOT1.2 SLOT2.2 SW1.2 SW1.5
SCLK-IN: SW1.1 SW1.3 SW1.4 SW1.6 U5.13
SCLK-MB: CN1.14 U3.3(OUTPUT) X1.8(OUT) X1.11(OUT)
Slot-1.L: C14.1 SLOT1.39
Slot-1.R: C15.1 SLOT1.40
Slot-2.L: C17.1 SLOT2.39
Slot-2.R: C18.1 SLOT2.40
SQH: CN1.12 U2.9(SQH) U5.11
SS: CN1.25 U1.13(D2) U2.12(LATCH_CLOCK) U5.26
Net-(C2-1): C2.1 C3.1 C4.2 C5.2 FUSE1.2 SW2.1
Net-(C14-2): C14.2 R3.1
Net-(C15-2): C15.2 R4.1
Net-(C16-2): C16.2 C19.1 R5.2 U6.1(OUT1)
Net-(C17-2): C17.2 R6.1
Net-(C18-2): C18.2 R7.1
Net-(C20-2): C20.2 R8.2 RV1.3
Net-(C21-1): C21.1 RV1.2
Net-(C21-2): C21.2 R10.1
Net-(C22-2): C22.2 R11.1
Net-(C23-2): C23.2 R12.1
Net-(C24-2): C24.2 C25.1 R13.2 U6.7(OUT2)
Net-(C26-2): C26.2 R14.2 RV1.6
Net-(C27-1): C27.1 RV1.5
Net-(C27-2): C27.2 R16.1
Net-(C30-1): C30.1 R19.1 R20.2 U7.2(IN1-)
Net-(C30-2): C30.2 C32.1 R19.2 U7.1(OUT1)
Net-(C31-1): C31.1 RV2.2
Net-(C31-2): C31.2 R20.1
Net-(C33-1): C33.1 R23.1 R24.2 U7.6(IN2-)
Net-(C33-2): C33.2 C35.1 R23.2 U7.7(OUT2)
Net-(C34-1): C34.1 RV2.5
Net-(C34-2): C34.2 R24.1
Net-(D1-2): D1.2(AC) DC1.1
Net-(J1-3): J1.3 R22.2
Net-(J1-4): J1.4 R21.2
Net-(LED1-1): LED1.1(C) R1.1
Net-(LED2-1): LED2.1(C) R2.1
Net-(SW2-2): SW2.2 U4.1(B)

Not connected (* = marked no-connect by the designer): SLOT1 3* 4* 19* 20* 21* 22* 23* 24* 33* 34*; SLOT2 3* 4* 19* 20* 21* 22* 23* 24* 33* 34*; SW1 7* 8*; SW2 7* 8*; U1 22(VCORE)* 23(3V3)*; U2 2(QC)* 3(QD)* 4(QE)* 5(QF)* 6(QG)* 7(QH)*; U3 1(Tri-state)*; X1 1(NC)* 2(X)* 3(X)* 5(X)* 6(X)* 9(X)* 10(X)* 12(X)* 13(X)*

## Notes on the sheets
sheet 1
- MPSEE Mode
- SS=MOSI
- CS2-CS7在主板上不使用
sheet 2
- 注意第一脚为GND
- /RD=Hi
- /WR=Lo
- SCLK输入开关
sheet 3
- BNX016效果一般，USB带来的噪音太大了。
- 应该做开关，切换外部5V输入或USB供电
- 加外置的USB滤波器有效果，但是还有噪音。所以应该给音频用独立5V
- 添加大容量电解电容，以消除电源噪音
- 电源线必须加粗
sheet 4
- 两个连接器，一个IN，一个OUT。
- eBUS输出端
- eBUS输入端
sheet 5
- 音频输入
- PJ-320苗条的耳机孔
- 可选下拉电容电阻
sheet 6
- 音频输出
